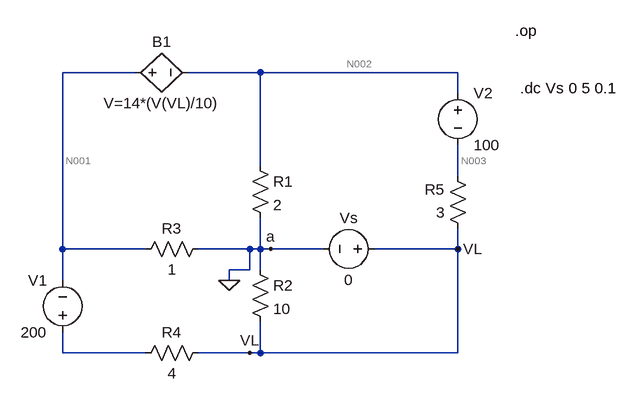
[diagram p0: schematic Schematic1.asc]
Schematic1.asc, the LTspice schematic file:
Version 4
SHEET 1 880 680
WIRE 16 16 -96 16
WIRE 208 16 96 16
WIRE 512 16 208 16
WIRE 512 48 512 16
WIRE 208 160 208 16
WIRE 512 176 512 128
WIRE -96 288 -96 16
WIRE 32 288 -96 288
WIRE 192 288 112 288
WIRE 208 288 208 240
WIRE 208 288 192 288
WIRE 224 288 208 288
WIRE 304 288 224 288
WIRE 512 288 512 256
WIRE 512 288 384 288
WIRE 192 320 192 288
WIRE 192 320 160 320
WIRE 208 320 208 288
WIRE -96 336 -96 288
WIRE 160 336 160 320
WIRE -96 448 -96 416
WIRE 32 448 -96 448
WIRE 192 448 112 448
WIRE 208 448 208 400
WIRE 208 448 192 448
WIRE 512 448 512 288
WIRE 512 448 208 448
FLAG 192 448 VL
FLAG 160 336 0
FLAG 512 288 VL
FLAG 224 288 a
SYMBOL res 192 144 R0
SYMATTR InstName R1
SYMATTR Value 2
SYMBOL res 192 304 R0
SYMATTR InstName R2
SYMATTR Value 10
SYMBOL res 128 272 R90
WINDOW 0 0 56 VBottom 2
WINDOW 3 32 56 VTop 2
SYMATTR InstName R3
SYMATTR Value 1
SYMBOL res 128 432 R90
WINDOW 0 0 56 VBottom 2
WINDOW 3 32 56 VTop 2
SYMATTR InstName R4
SYMATTR Value 4
SYMBOL res 528 272 R180
WINDOW 0 36 76 Left 2
WINDOW 3 36 40 Left 2
SYMATTR InstName R5
SYMATTR Value 3
SYMBOL voltage -96 432 R180
WINDOW 0 24 96 Left 2
WINDOW 3 24 16 Left 2
SYMATTR InstName V1
SYMATTR Value 200
SYMBOL voltage 512 32 R0
SYMATTR InstName V2
SYMATTR Value 100
SYMBOL bv 0 16 R270
WINDOW 0 32 56 VTop 2
WINDOW 3 -32 56 VBottom 2
SYMATTR InstName B1
SYMATTR Value V=14*(V(VL)/10)
SYMBOL voltage 400 288 R90
WINDOW 0 -32 56 VBottom 2
WINDOW 3 32 56 VTop 2
SYMATTR InstName Vs
SYMATTR Value 0
TEXT 600 -48 Left 2 !.op
TEXT 608 40 Left 2 !.dc Vs 0 5 0.1

The netlist it stands for:
* Schematic1.asc
R1 N002 0 2
R2 0 VL 10
R3 0 N001 1
R4 VL N004 4
R5 VL N003 3
V1 N004 N001 200
V2 N002 N003 100
B1 N001 N002 V=14*(V(VL)/10)
Vs VL 0 0
.op
.dc Vs 0 5 0.1
.backanno
.end

* Results of the author's LTspice run, read from the files saved beside the schematic
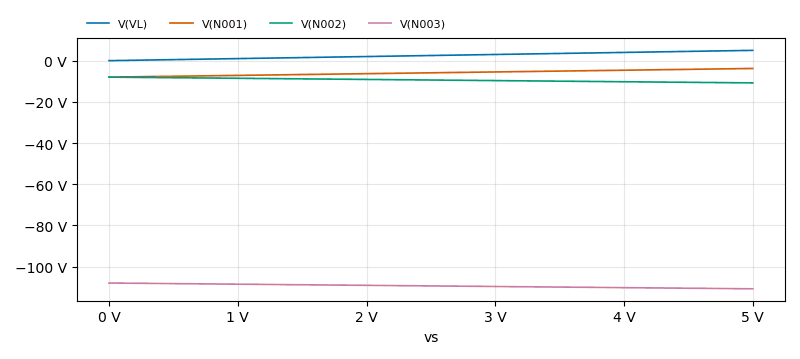
[diagram p1: DC transfer characteristic of Schematic1.asc, plotted from the saved traces]
* DC transfer characteristic, 1 run:
*   V(VL): 0 V at vs=0 V, 5 V at vs=5 V, min 0 V, max 5 V
*   V(N001): -8 V at vs=0 V, -3.8 V at vs=5 V, min -8 V, max -3.8 V
*   V(N002): -8 V at vs=0 V, -10.8 V at vs=5 V, min -10.8 V, max -8 V
*   V(N003): -108 V at vs=0 V, -110.8 V at vs=5 V, min -110.8 V, max -108 V